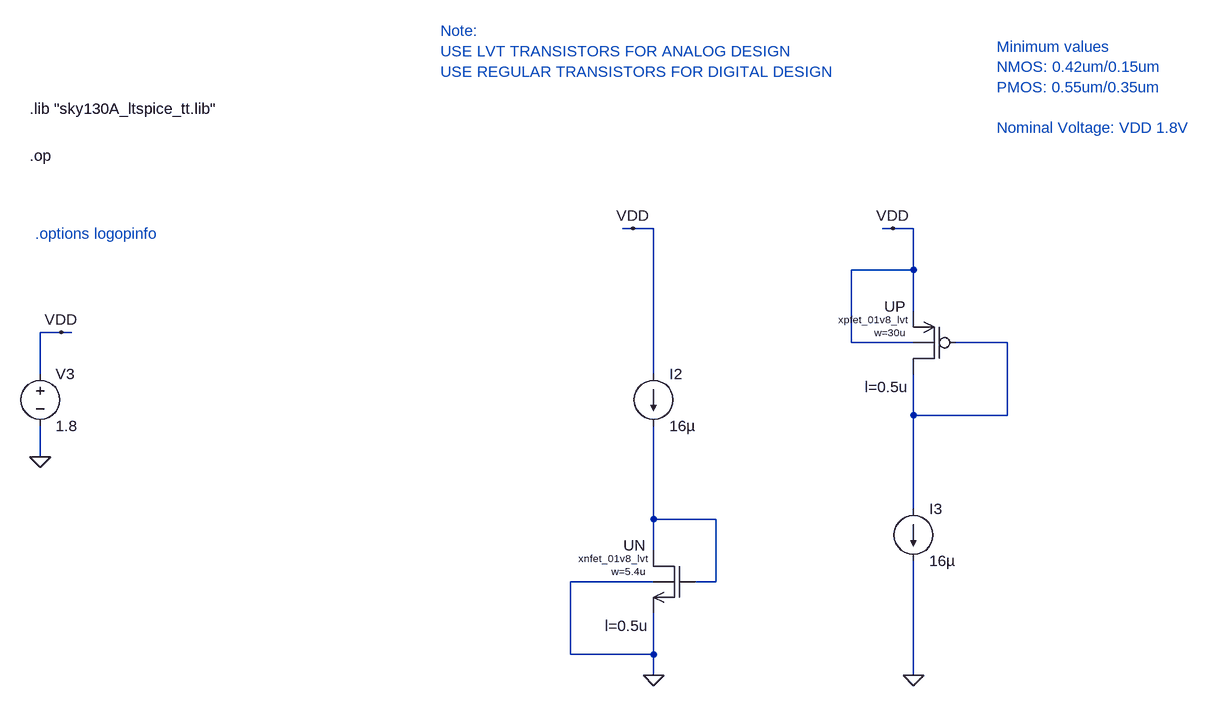
[diagram p0: schematic OTA_Simple_Sizing.asc]
OTA_Simple_Sizing.asc, the LTspice schematic file:
Version 4.1
SHEET 1 6080 1492
WIRE 1056 -192 1040 -192
WIRE 1088 -192 1056 -192
WIRE 1456 -192 1440 -192
WIRE 1488 -192 1456 -192
WIRE 1488 -128 1488 -192
WIRE 1488 -128 1392 -128
WIRE 1488 -64 1488 -128
WIRE 176 -32 144 -32
WIRE 192 -32 176 -32
WIRE 1392 -16 1392 -128
WIRE 1488 -16 1392 -16
WIRE 1632 -16 1552 -16
WIRE 144 32 144 -32
WIRE 1088 32 1088 -192
WIRE 1488 96 1488 32
WIRE 1632 96 1632 -16
WIRE 1632 96 1488 96
WIRE 144 160 144 112
WIRE 1488 240 1488 96
WIRE 1088 256 1088 112
WIRE 1184 256 1088 256
WIRE 1088 304 1088 256
WIRE 1088 352 960 352
WIRE 1184 352 1184 256
WIRE 1184 352 1152 352
WIRE 960 464 960 352
WIRE 1088 464 1088 400
WIRE 1088 464 960 464
WIRE 1088 496 1088 464
WIRE 1488 496 1488 320
FLAG 176 -32 VDD
FLAG 144 160 0
FLAG 1088 496 0
FLAG 1056 -192 VDD
FLAG 1488 496 0
FLAG 1456 -192 VDD
DATAFLAG 1152 256 ""
DATAFLAG 1536 96 "$"
SYMBOL voltage 144 16 R0
WINDOW 123 0 0 Left 0
WINDOW 39 0 0 Left 0
SYMATTR InstName V3
SYMATTR Value 1.8
SYMBOL current 1088 32 R0
WINDOW 123 0 0 Left 0
WINDOW 39 0 0 Left 0
SYMATTR InstName I2
SYMATTR Value 16µ
SYMBOL xnch 1136 304 M0
WINDOW 123 56 116 Left 2
SYMATTR Value2 l=0.5u
SYMATTR InstName UN
SYMATTR Value w=5.4u
SYMATTR SpiceModel xnfet_01v8_lvt
SYMBOL current 1488 240 R0
WINDOW 123 0 0 Left 0
WINDOW 39 0 0 Left 0
SYMATTR InstName I3
SYMATTR Value 16µ
SYMBOL xpch 1536 -64 M0
WINDOW 123 56 116 Left 2
SYMATTR Value2 l=0.5u
SYMATTR InstName UP
SYMATTR Value w=30u
SYMATTR SpiceModel xpfet_01v8_lvt
TEXT 128 -304 Left 2 !.op
TEXT 128 -376 Left 2 !.lib "sky130A_ltspice_tt.lib"
TEXT 136 -184 Left 2 ;.options logopinfo
TEXT 1616 -472 Left 2 ;Minimum values\nNMOS: 0.42um/0.15um\nPMOS: 0.55um/0.35um\n \nNominal Voltage: VDD 1.8V
TEXT 760 -496 Left 2 ;Note:\nUSE LVT TRANSISTORS FOR ANALOG DESIGN\nUSE REGULAR TRANSISTORS FOR DIGITAL DESIGN

The netlist it stands for:
* OTA_Simple_Sizing.asc
V3 VDD 0 1.8
I2 VDD N002 16µ
X§UN N002 N002 0 0 xnfet_01v8_lvt w=5.4u l=0.5u  ; pins D G S B
I3 N001 0 16µ
X§UP N001 N001 VDD VDD xpfet_01v8_lvt w=30u l=0.5u  ; pins D G S B
.op
.lib "sky130A_ltspice_tt.lib"
* .options logopinfo
* Minimum values
* NMOS: 0.42um/0.15um
* PMOS: 0.55um/0.35um
* Nominal Voltage: VDD 1.8V
* Note:
* USE LVT TRANSISTORS FOR ANALOG DESIGN
* USE REGULAR TRANSISTORS FOR DIGITAL DESIGN
.backanno
.end